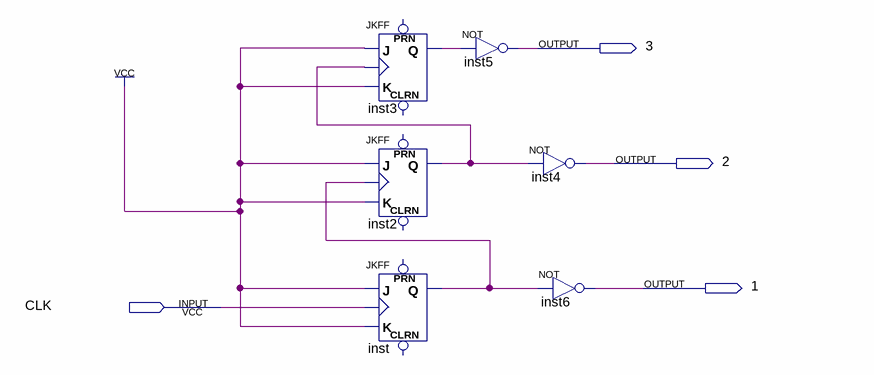
[diagram p0: schematic sheet]
// Quartus schematic project2.bdf as structural Verilog: 6 symbols, 4 pins
module project2 (
  input  CLK,
  output \3 ,
  output \2 ,
  output \1 
);

  wire inst2_q, inst3_q, inst_q;

  JKFF inst3 (.K(1'b1), .J(1'b1), .CLK(inst2_q), .Q(inst3_q));  // open: PRN, CLRN
  JKFF inst2 (.K(1'b1), .J(1'b1), .CLK(inst_q), .Q(inst2_q));  // open: PRN, CLRN
  JKFF inst (.K(1'b1), .J(1'b1), .CLK(CLK), .Q(inst_q));  // open: PRN, CLRN
  not inst5 (\3 , inst3_q);
  not inst4 (\2 , inst2_q);
  not inst6 (\1 , inst_q);
endmodule
